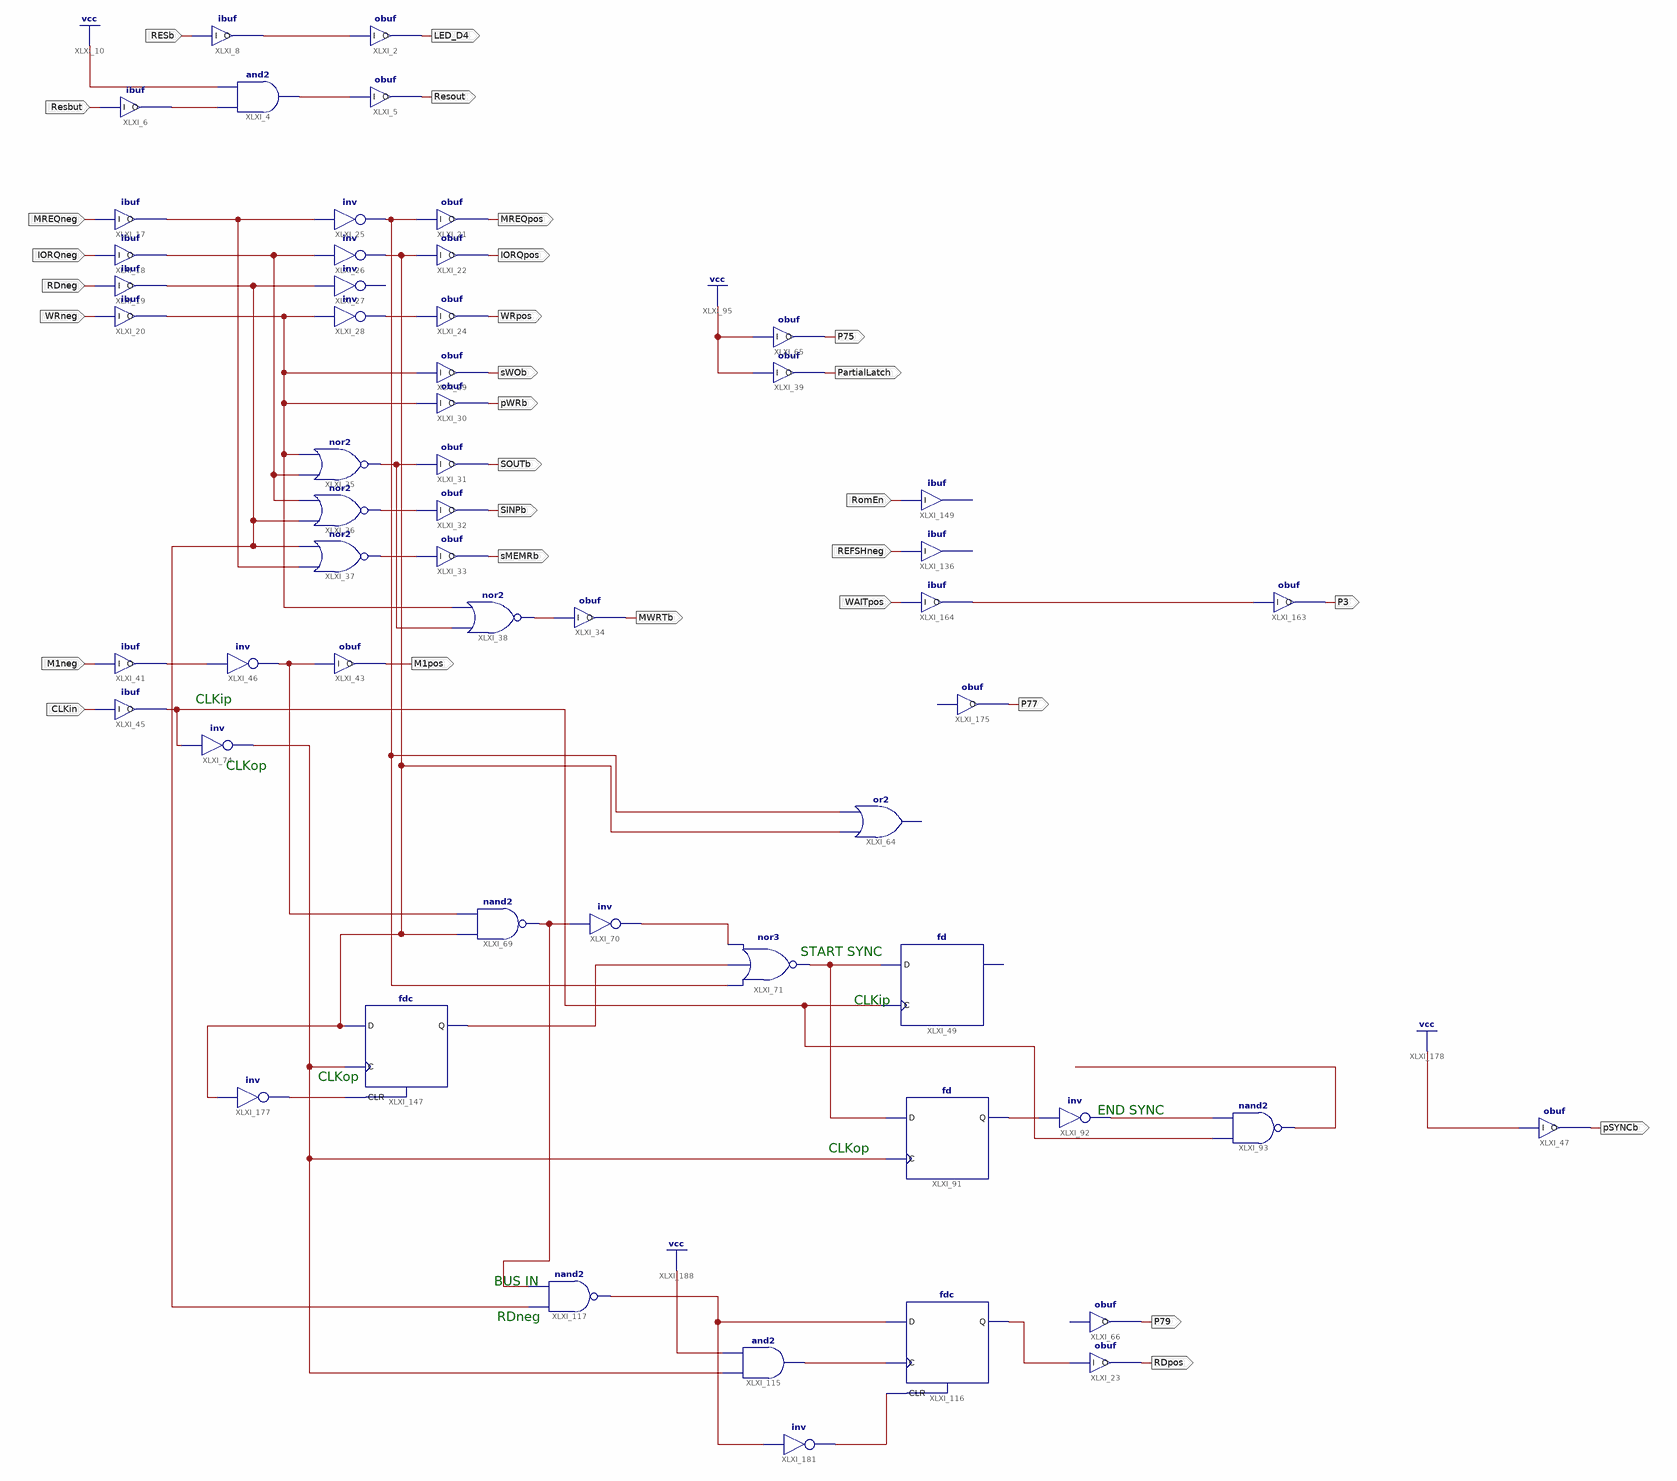
[diagram p0: schematic sheet 1]
// Xilinx ISE schematic IC1v2_5.sch (xc9500) as structural Verilog: 55 symbols, 30 ports
module IC1v2_5 (
  input  Resbut,
  input  RESb,
  input  MREQneg,
  input  IORQneg,
  input  RDneg,
  input  WRneg,
  input  M1neg,
  input  CLKin,
  input  RomEn,
  input  REFSHneg,
  input  WAITpos,
  output Resout,
  output LED_D4,
  output MREQpos,
  output IORQpos,
  output WRpos,
  output sWOb,
  output pWRb,
  output SOUTb,
  output SINPb,
  output sMEMRb,
  output MWRTb,
  output PartialLatch,
  output M1pos,
  output P75,
  output P3,
  output P77,
  output pSYNCb,
  output P79,
  output RDpos
);

  wire XLXN_6, XLXN_10, XLXN_13, XLXN_27, XLXN_40, XLXN_44, XLXN_45, XLXN_46, XLXN_48, XLXN_54, XLXN_56,
       XLXN_58, XLXN_64, XLXN_67, XLXN_75, XLXN_129, XLXN_131, XLXN_133, XLXN_134, XLXN_155, XLXN_157,
       XLXN_158, XLXN_169, XLXN_172, XLXN_173, XLXN_177, XLXN_180, XLXN_331, XLXN_342, XLXN_344, XLXN_347;

  and XLXI_4 (XLXN_13, XLXN_6, 1'b1);
  obuf XLXI_5 (.I(XLXN_13), .O(Resout));
  ibuf XLXI_6 (.I(Resbut), .O(XLXN_6));
  obuf XLXI_2 (.I(XLXN_10), .O(LED_D4));
  ibuf XLXI_8 (.I(RESb), .O(XLXN_10));
  ibuf XLXI_17 (.I(MREQneg), .O(XLXN_58));
  ibuf XLXI_18 (.I(IORQneg), .O(XLXN_54));
  ibuf XLXI_19 (.I(RDneg), .O(XLXN_56));
  ibuf XLXI_20 (.I(WRneg), .O(XLXN_40));
  obuf XLXI_21 (.I(XLXN_75), .O(MREQpos));
  obuf XLXI_22 (.I(XLXN_173), .O(IORQpos));
  obuf XLXI_24 (.I(XLXN_27), .O(WRpos));
  not XLXI_25 (XLXN_75, XLXN_58);
  not XLXI_26 (XLXN_173, XLXN_54);
  // inv XLXI_27 has open pins: I=XLXN_56, O=open
  not XLXI_28 (XLXN_27, XLXN_40);
  obuf XLXI_29 (.I(XLXN_40), .O(sWOb));
  obuf XLXI_30 (.I(XLXN_40), .O(pWRb));
  obuf XLXI_31 (.I(XLXN_48), .O(SOUTb));
  obuf XLXI_32 (.I(XLXN_46), .O(SINPb));
  obuf XLXI_33 (.I(XLXN_45), .O(sMEMRb));
  obuf XLXI_34 (.I(XLXN_44), .O(MWRTb));
  nor XLXI_35 (XLXN_48, XLXN_54, XLXN_40);
  nor XLXI_36 (XLXN_46, XLXN_56, XLXN_54);
  nor XLXI_37 (XLXN_45, XLXN_58, XLXN_56);
  nor XLXI_38 (XLXN_44, XLXN_48, XLXN_40);
  obuf XLXI_39 (.I(1'b1), .O(PartialLatch));
  ibuf XLXI_41 (.I(M1neg), .O(XLXN_64));
  obuf XLXI_43 (.I(XLXN_67), .O(M1pos));
  ibuf XLXI_45 (.I(CLKin), .O(XLXN_133));
  not XLXI_46 (XLXN_67, XLXN_64);
  fd XLXI_49 (.C(XLXN_133), .D(XLXN_155));  // open: Q
  // or2 XLXI_64 has open pins: I0=XLXN_173, I1=XLXN_75, O=open
  nand XLXI_69 (XLXN_342, XLXN_173, XLXN_67);
  not XLXI_70 (XLXN_129, XLXN_342);
  nor XLXI_71 (XLXN_155, XLXN_75, XLXN_134, XLXN_129);
  not XLXI_74 (XLXN_131, XLXN_133);
  fd XLXI_91 (.C(XLXN_131), .D(XLXN_155), .Q(XLXN_157));
  not XLXI_92 (XLXN_158, XLXN_157);
  nand XLXI_93 (XLXN_344, XLXN_133, XLXN_158);
  obuf XLXI_65 (.I(1'b1), .O(P75));
  ibuf XLXI_149 (.I(RomEn));  // open: O
  ibuf XLXI_136 (.I(REFSHneg));  // open: O
  ibuf XLXI_164 (.I(WAITpos), .O(XLXN_169));
  obuf XLXI_163 (.I(XLXN_169), .O(P3));
  obuf XLXI_175 (.O(P77));  // open: I
  fdc XLXI_147 (.C(XLXN_131), .CLR(XLXN_172), .D(XLXN_173), .Q(XLXN_134));
  not XLXI_177 (XLXN_172, XLXN_173);
  obuf XLXI_47 (.I(1'b1), .O(pSYNCb));
  and XLXI_115 (XLXN_177, XLXN_131, 1'b1);
  fdc XLXI_116 (.C(XLXN_177), .CLR(XLXN_331), .D(XLXN_180), .Q(XLXN_347));
  nand XLXI_117 (XLXN_180, XLXN_56, XLXN_342);
  not XLXI_181 (XLXN_331, XLXN_180);
  obuf XLXI_66 (.O(P79));  // open: I
  obuf XLXI_23 (.I(XLXN_347), .O(RDpos));

  // Notes on the sheet:
  //   CLKip
  //   CLKop
  //   START SYNC
  //   CLKip
  //   CLKop
  //   END SYNC
  //   CLKop
  //   BUS IN
  //   RDneg
endmodule
